# EAGLE design SISTEMA DE ALARMA LÁSER (EAGLE 9.5.2)
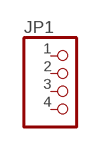
[diagram p0: schematic, sheet 1, part 1 of 2]
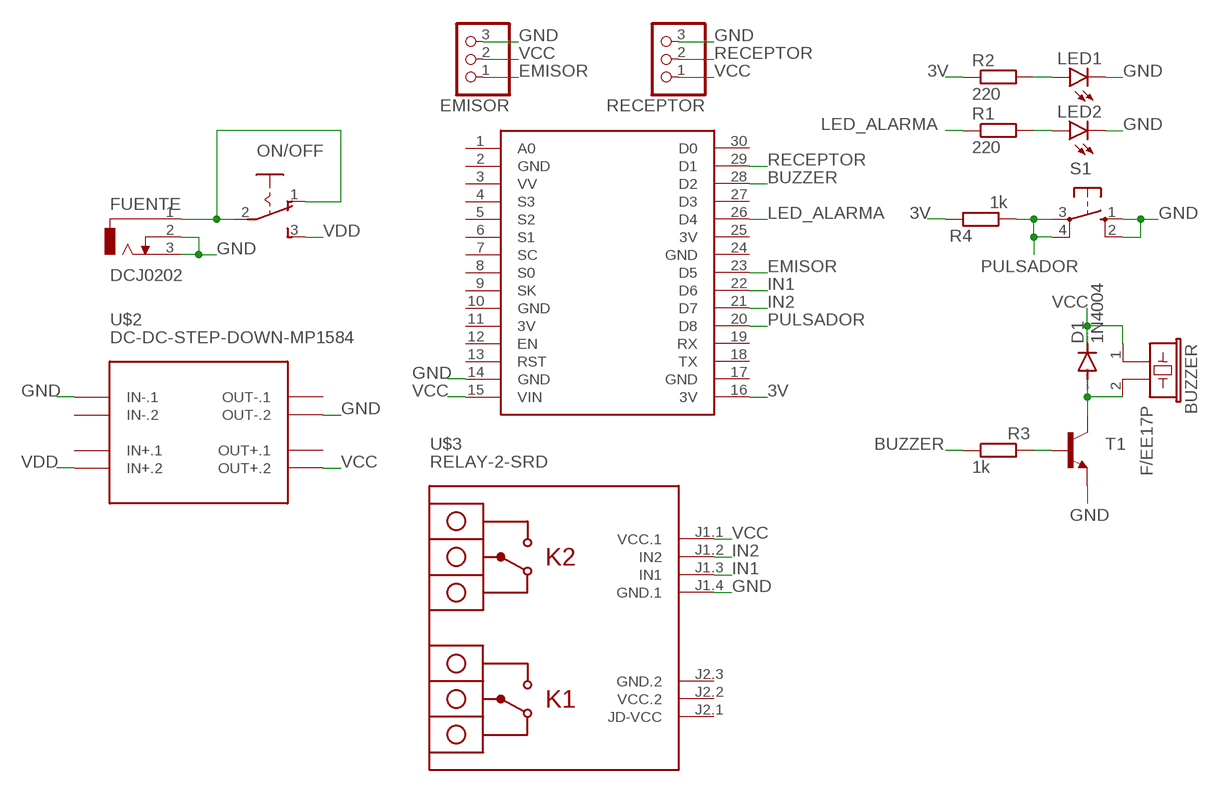
[diagram p1: schematic, sheet 1, part 2 of 2]

## Parts
BUZZER  F/EE17P  [F/EE17P]
D1  1N4004  [DO41-10]
EMISOR  PINHD-1X3  [1X03]
FUENTE  DCJ0202  [DCJ0202]
JP1  PINHD-1X4  [1X04]
LED1  LED5MM  [LED5MM]
LED2  LED5MM  [LED5MM]
ON/OFF  255SB  [255SB]
R1  220  R-EU_0204/7  [0204/7]
R2  220  R-EU_0204/7  [0204/7]
R3  1k  R-EU_0204/7  [0204/7]
R4  1k  R-EU_0204/7  [0204/7]
RECEPTOR  PINHD-1X3  [1X03]
S1  10-XX  [B3F-10XX]
T1  2N2222-NPN-TO92-EBC  [TO92-EBC]
U$1  NODEMCU  [NODEMCU]
U$2  DC-DC-STEP-DOWN-MP1584  [DC-DC-STEP-DOWN-MP1584]
U$3  RELAY-2-SRD  [RELAY-2-SRD]

## Nets
3V: R2.1 R4.2 U$1.16(3V)
BUZZER: R3.1 U$1.28(D2)
EMISOR: EMISOR.1 U$1.23(D5)
GND: EMISOR.3 FUENTE.2 FUENTE.3 LED1.K(C) LED2.K(C) RECEPTOR.3 S1.1(S) S1.2(S1) T1.E U$1.14(GND) U$2.IN-.1 U$2.OUT-.2 U$3.J1.4(GND.1)
IN1: U$1.22(D6) U$3.J1.3(IN1)
IN2: U$1.21(D7) U$3.J1.2(IN2)
LED_ALARMA: R1.1 U$1.26(D4)
N$1: LED1.A R2.2
N$2: LED2.A R1.2
N$3: R3.2 T1.B
N$4: BUZZER.2 D1.A T1.C
N$5: FUENTE.1 ON/OFF.1(O) ON/OFF.2(P)
PULSADOR: R4.1 S1.3(P) S1.4(P1) U$1.20(D8)
RECEPTOR: RECEPTOR.2 U$1.29(D1)
VCC: BUZZER.1 D1.C EMISOR.2 RECEPTOR.1 U$1.15(VIN) U$2.OUT+.2 U$3.J1.1(VCC.1)
VDD: ON/OFF.3(S) U$2.IN+.2
Unconnected: JP1.1 JP1.2 JP1.3 JP1.4 U$1.1(A0) U$1.3(VV) U$1.4(S3) U$1.5(S2) U$1.6(S1) U$1.7(SC) U$1.8(S0) U$1.9(SK) U$1.12(EN) U$1.13(RST) U$1.18(TX) U$1.19(RX) U$1.27(D3) U$1.30(D0) U$2.IN+.1 U$2.IN-.2 U$2.OUT+.1 U$2.OUT-.1 U$3.J2.1(JD-VCC)

## Power pins joined to a net without a drawn wire
3V: U$1.11(3V) U$1.25(3V)
GND: U$1.2(GND) U$1.10(GND) U$1.17(GND) U$1.24(GND)
GND.2: U$3.J2.3(GND.2)
VCC.2: U$3.J2.2(VCC.2)

## Library data of the parts
BUZZER = buzzer:F/EE17P: BUZZER Source: Buerklin; OC_FARNELL: unknown; OC_NEWARK: unknown
D1 = diode:1N4004: DIODE general purpose rectifier, 1 A
EMISOR RECEPTOR = pinhead:PINHD-1X3: PIN HEADER
FUENTE = con-jack:DCJ0202: DC POWER JACK Source: DCJ0202.pdf; OC_FARNELL: unknown; OC_NEWARK: unknown
JP1 = pinhead:PINHD-1X4: PIN HEADER
LED1 LED2 = led:LED: LED OSRAM: - CHIPLED LG R971, LG N971, LY N971, LG Q971, LY Q971, LO R971, LY R971 LH N974, LH R974 LS Q976, LO Q976, LY Q976 LO Q996 - Hyper CHIPLED LW Q18S LB Q993, LB Q99A, LB R99A - SideLED LS A670, LO A670, LY A670, LG A670, LP A670 LB A673, LV A673, LT A673, LW A673 LH A674 LY A675 LS A676, LA A676, LO A676, LY A676, LW A676 LS A679, LY A679, LG A679 - Hyper Micro SIDELED® LS Y876, LA Y876, LO Y876, LY Y876 LT Y87S - SmartLED LW L88C, LW L88S LB L89C, LB L89S, LG L890 LS L89K, LO L89K, LY L89K LS L896, LA L896, LO L896, LY L896 - TOPLED LS T670, LO T670, LY T670, LG T670, LP T670 LSG T670, LSP T670, LSY T670, LOP T670, LYG T670 LG T671, LOG T671, LSG T671 LB T673, LV T673, LT T673, LW T673 LH T674 LS T676, LA T676, LO T676, LY T676, LB T676, LH T676, LSB T676, LW T676 LB T67C, LV T67C, LT T67C, LS T67K, LO T67K, LY T67K, LW E67C LS E67B, LA E67B, LO E67B, LY E67B, LB E67C, LV E67C, LT E67C LW T67C LS T679, LY T679, LG T679 LS T770, LO T770, LY T770, LG T770, LP T770 LB T773, LV T773, LT T773, LW T773 LH T774 LS E675, LA E675, LY E675, LS T675 LS T776, LA T776, LO T776, LY T776, LB T776 LHGB T686 LT T68C, LB T68C - Hyper Mini TOPLED® LB M676 - Mini TOPLED Santana® LG M470 LS M47K, LO M47K, LY M47K Source: http://www.osram.convergy.de LUXEON: - LUMILED® LXK2-PW12-R00, LXK2-PW12-S00, LXK2-PW14-U00, LXK2-PW14-V00 LXK2-PM12-R00, LXK2-PM12-S00, LXK2-PM14-U00 LXK2-PE12-Q00, LXK2-PE12-R00, LXK2-PE12-S00, LXK2-PE14-T00, LXK2-PE14-U00 LXK2-PB12-K00, LXK2-PB12-L00, LXK2-PB12-M00, LXK2-PB14-N00, LXK2-PB14-P00, LXK2-PB14-Q00 LXK2-PR12-L00, LXK2-PR12-M00, LXK2-PR14-Q00, LXK2-PR14-R00 LXK2-PD12-Q00, LXK2-PD12-R00, LXK2-PD12-S00 LXK2-PH12-R00, LXK2-PH12-S00 LXK2-PL12-P00, LXK2-PL12-Q00, LXK2-PL12-R00 Source: www.luxeon.com KINGBRIGHT: KA-3528ASYC Source: www.kingbright.com
ON/OFF = switch:255SB: SLIDING SWITCH Distributor Buerklin, 11G810
R1-R4 = resistor:R-EU_: RESISTOR, European symbol
S1 = switch-omron:10-XX: OMRON SWITCH; MPN: B3F-1000; OC_FARNELL: 176432; OC_NEWARK: 36M3542
T1 = Robot Soccer:*-NPN-: NPN Transistror
U$1 = nodemcu(1):NODEMCU
U$2 = MP1584_V2:DC-DC-STEP-DOWN-MP1584: DC/DC Step-Down Regulator based on MP1584 chip MP1584 datasheet available here: http://www.haoyuelectronics.com/Attachment/MP1584/MP1584.pdf Click here to find device on ebay.com <http://www.ebay.com/sch/mp1584+module>
U$3 = diy-modules:RELAY-2-SRD: 2-Channel Relay Module based on SRD-05VDC-SL-C relays Click here to find device on ebay.com <http://www.ebay.com/sch/two+channel+relay+module+optocoupler+5v>

## Board
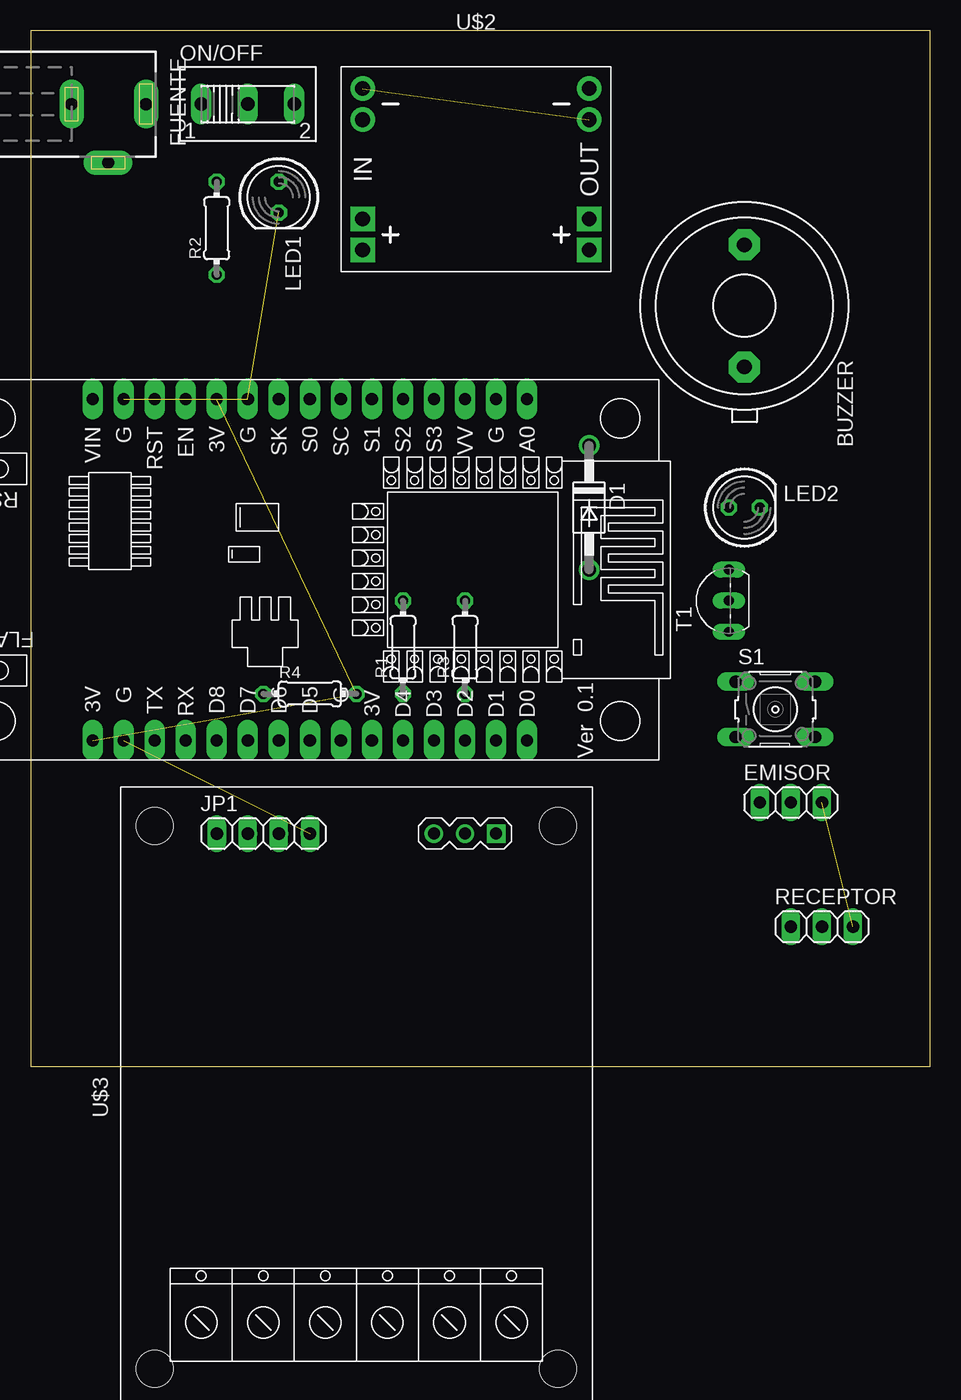
[diagram p2: board, top side]
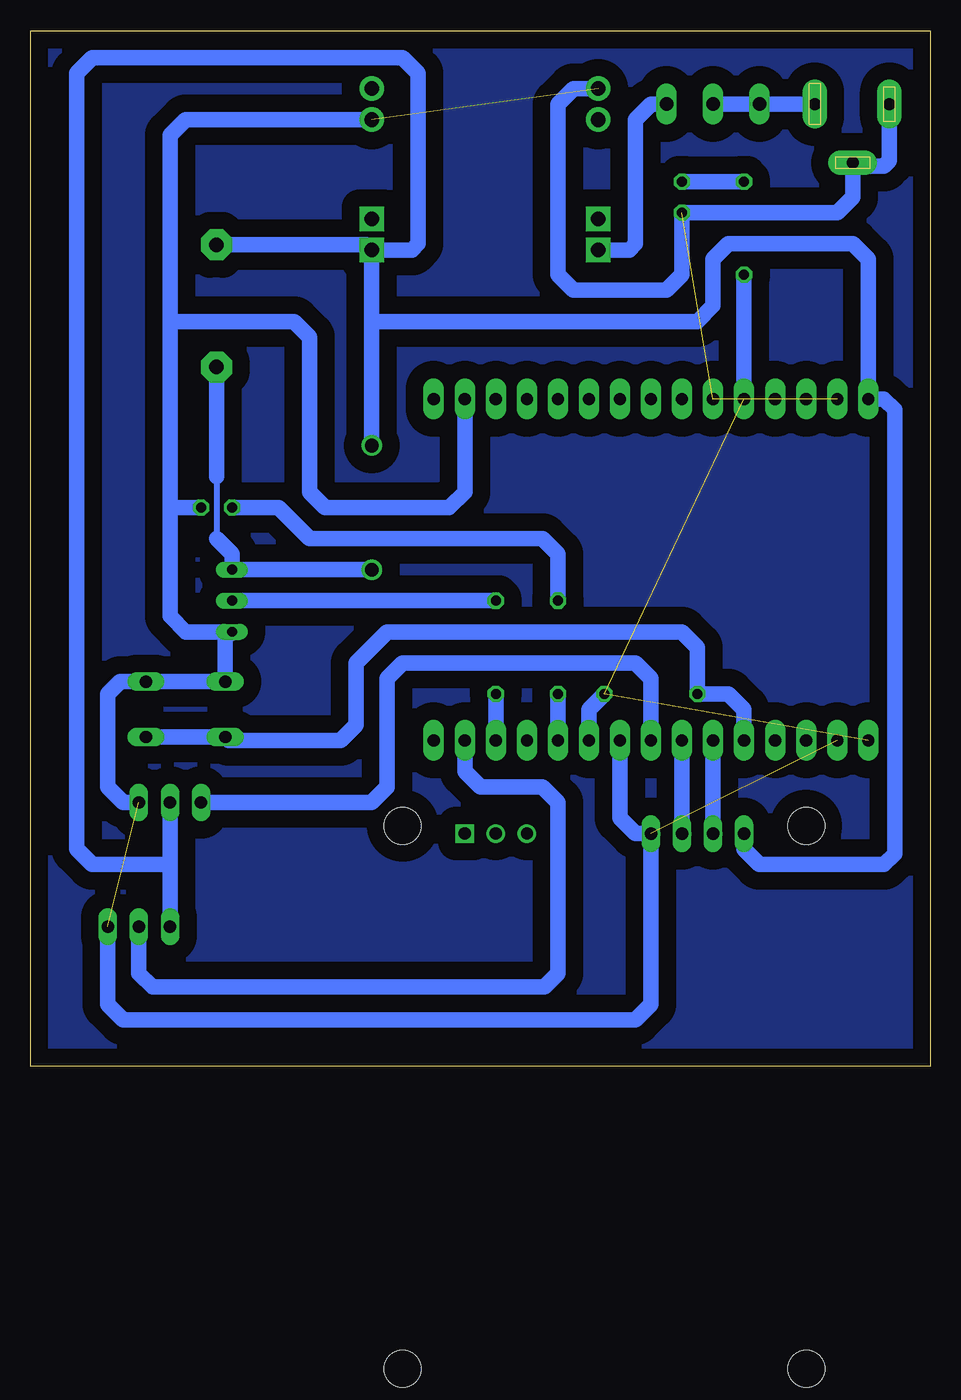
[diagram p3: board, bottom side, seen from below]

Size 73.64 x 84.76 mm. Coordinates in mm from the lower left corner, seen from the top.
Outline: 0,0 73.64,0 73.64,84.76 0,84.76 0,0
Copper layers (1*16): Top 0.035mm / dielectric 1.5mm / Bottom 0.035mm
Design rules "default": minimum track width 6mil, minimum drill 0.35mm, track to track 6mil, track to pad 6mil, pad to pad 6mil, via to via 6mil, smd to smd 6mil, copper to edge 40mil, drill to drill 6mil, minimum pad ring 10mil, minimum via ring 8mil, stop-mask expansion 4mil, vias tented up to drill 0mil, thermal gap 10mil

### Footprints (pad centres in the part's own frame; a part is rotated, then mirrored left to right if it is on the bottom)
F/EE17P = drill 1.194 pad 2.54 octagon: 1 -5.004,0; 2 5.004,0
DO41-10 = drill 1.118: A 5.08,0; C -5.08,0
1X03 = drill 1.016 long: 1 -2.54,0; 2 0,0; 3 2.54,0
DCJ0202 = drill 1 pad 2 long: 1 0,3.1; 2 4.8,0; 3 0,-3
1X04 = drill 1.016 long: 1 -3.81,0; 2 -1.27,0; 3 1.27,0; 4 3.81,0
LED5MM = drill 0.813 octagon: A -1.27,0; K 1.27,0
255SB = drill 1.118 long: 1 -3.81,0; 2 0,0; 3 3.81,0
0204/7 = drill 0.813 octagon: 1 -3.81,0; 2 3.81,0
B3F-10XX = drill 1.016 long: 1 -3.251,2.261; 2 3.251,2.261; 3 -3.251,-2.261; 4 3.251,-2.261
TO92-EBC = drill 0.813 long: B 0,-1.27; C 2.54,-1.27; E -2.54,-1.27
NODEMCU = drill 1 pad 1.676 long: 1 -13.97,17.78; 2 -13.97,15.24; 3 -13.97,12.7; 4 -13.97,10.16; 5 -13.97,7.62; 6 -13.97,5.08; 7 -13.97,2.54; 8 -13.97,0; 9 -13.97,-2.54; 10 -13.97,-5.08; 11 -13.97,-7.62; 12 -13.97,-10.16; 13 -13.97,-12.7; 14 -13.97,-15.24; 15 -13.97,-17.78; 16 13.97,-17.78; 17 13.97,-15.24; 18 13.97,-12.7; 19 13.97,-10.16; 20 13.97,-7.62; 21 13.97,-5.08; 22 13.97,-2.54; 23 13.97,0; 24 13.97,2.54; 25 13.97,5.08; 26 13.97,7.62; 27 13.97,10.16; 28 13.97,12.7; 29 13.97,15.24; 30 13.97,17.78
DC-DC-STEP-DOWN-MP1584 = drill 1.2 pad 2 square: IN+.1 -9.271,-4.064; IN+.2 -9.271,-6.604; OUT+.1 9.271,-4.064; OUT+.2 9.271,-6.604 | drill 1.2 pad 2: IN-.1 -9.271,6.604; IN-.2 -9.271,4.064; OUT-.1 9.271,6.604; OUT-.2 9.271,4.064
RELAY-2-SRD = drill 1 square: J1.1 21.59,11.43; J2.1 21.59,-11.43 | drill 1: J1.2 21.59,8.89; J1.3 21.59,6.35; J1.4 21.59,3.81; J2.2 21.59,-8.89; J2.3 21.59,-6.35 | hole 3: -22.225,16.51; 22.225,16.51; 22.225,-16.51; -22.225,-16.51

### Placement (x,y rotation side)
BUZZER  58.42,62.23 270 top
D1  45.72,45.72 270 top
EMISOR  62.23,21.59 0 top
FUENTE  6.35,78.74 270 top
JP1  19.05,19.05 0 top
LED1  20.32,71.12 270 top
LED2  58.42,45.72 0 top
ON/OFF  17.78,78.74 0 top
R1  30.48,34.29 90 top
R2  15.24,68.58 90 top
R3  35.56,34.29 90 top
R4  22.86,30.48 0 top
RECEPTOR  64.77,11.43 0 top
S1  60.96,29.21 0 top
T1  55.88,38.1 90 top
U$1  22.86,40.64 270 top
U$2  36.45,73.41 0 top
U$3  26.67,-2.54 90 top

### Tracks (layer width: path | path; a pad name or v marks a point on that pad's centre or on a via)
3V  (2 unrouted)
  Bottom 1.27: U$1.25 27.94,29.21 R4.2 | R2.1 U$1.11
BUZZER
  Bottom 1.27: U$1.28 R3.1
EMISOR
  Bottom 1.27: U$1.23 22.86,31.75 24.13,33.02 43.18,33.02 44.45,31.75 44.45,22.86 44.47,22.84 44.48,22.84 45.73,21.59 EMISOR.1
GND  (5 unrouted)
  Bottom 1.27: FUENTE.3 3.35,74.12 3.81,73.66 6.07,73.66 FUENTE.2 6.35,71.12 7.62,69.85 LED1.K 20.32,64.77 21.59,63.5 29.21,63.5 30.48,64.77 30.48,78.74 29.21,80.01 U$2.IN-.1 | U$1.24 25.4,20.32 24.13,19.05 U$3.J1.4 22.86,5.08 24.13,3.81 66.04,3.81 67.31,5.08 RECEPTOR.3 | U$2.OUT-.2 60.96,77.47 62.23,76.2 62.23,60.96 | 62.23,60.96 52.07,60.96 50.8,59.69 50.8,46.99 49.53,45.72 39.37,45.72 38.1,46.99 U$1.2 | EMISOR.3 66.04,21.59 67.31,22.86 67.31,30.48 66.32,31.47 S1.2 S1.1 57.71,35 T1.E 60.96,35.56 62.23,36.83 62.23,45.72 | LED2.K 62.23,45.72 | 62.23,45.72 62.23,60.96
IN1
  Bottom 1.27: U$1.22 U$3.J1.3
IN2
  Bottom 1.27: U$1.21 U$3.J1.2
LED_ALARMA
  Bottom 1.27: U$1.26 R1.1
N$1
  Bottom 1.27: LED1.A R2.2
N$2
  Bottom 1.27: LED2.A 53.34,45.72 50.8,43.18 31.75,43.18 30.48,41.91 R1.2
N$3
  Bottom 1.27: R3.2 T1.B
N$4
  Bottom 0.508: 58.42,48.26 58.42,43.18
  Bottom 1.27: D1.A T1.C 57.15,41.91 58.42,43.18 | 58.5,57.15 BUZZER.2 58.42,48.26
N$5
  Bottom 1.27: FUENTE.1 ON/OFF.1 ON/OFF.2
N$6
  pour Bottom (isolate 1.422): 0,85.09 73.66,85.09 73.66,0 0,0
PULSADOR
  Bottom 1.27: U$1.20 15.24,29.21 16.51,30.48 R4.1 19.05,34.29 20.32,35.56 44.45,35.56 46.99,33.02 46.99,27.94 48.26,26.67 57.43,26.67 S1.3 S1.4
RECEPTOR
  Bottom 1.27: U$1.29 38.1,24.13 36.83,22.86 31.75,22.86 30.48,21.59 30.48,7.62 31.6,6.5 63.65,6.5 64.77,7.62 RECEPTOR.2
VCC
  Bottom 1.27: U$3.J1.1 15.24,17.78 13.97,16.51 3.81,16.51 2.92,17.4 2.92,53.72 3.81,54.61 U$1.15 5.08,66.04 6.35,67.31 16.51,67.31 17.78,66.04 17.78,62.23 19.05,60.96 45.72,60.96 | U$2.OUT+.2 45.72,60.96 | D1.C 45.72,60.96 | BUZZER.1 46.15,67.23 U$2.OUT+.2 | EMISOR.2 62.23,16.51 | 62.23,16.51 RECEPTOR.1 | U$2.OUT+.2 42.42,66.8 41.91,67.31 41.91,81.28 43.18,82.55 68.58,82.55 69.85,81.28 69.85,17.78 68.58,16.51 62.23,16.51
VDD
  Bottom 1.27: ON/OFF.3 22.86,78.74 24.13,77.47 24.13,67.31 24.64,66.8 U$2.IN+.2